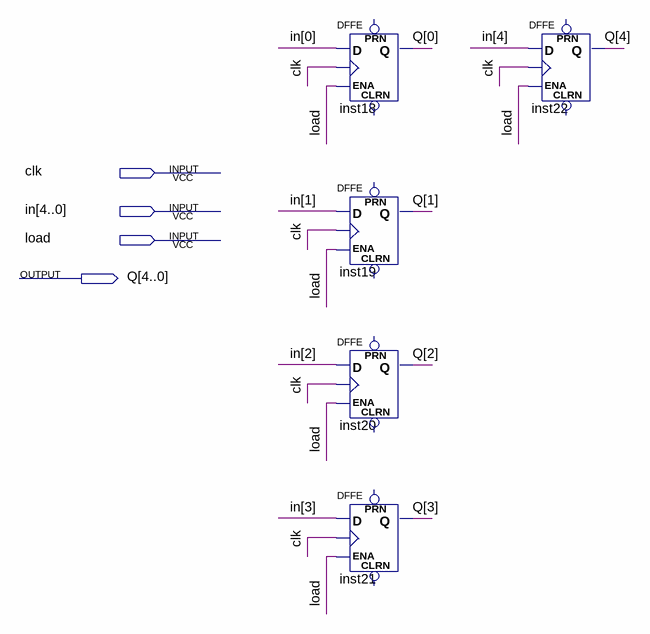
[diagram p0: schematic sheet]
// Quartus schematic Register5.bdf as structural Verilog: 5 symbols, 4 pins
module Register5 (
  input  clk,
  input  [4:0] in,
  input  load,
  output [4:0] Q
);

  DFFE inst18 (.D(in[0]), .CLK(clk), .ENA(load), .Q(Q[0]));  // open: PRN, CLRN
  DFFE inst19 (.D(in[1]), .CLK(clk), .ENA(load), .Q(Q[1]));  // open: PRN, CLRN
  DFFE inst20 (.D(in[2]), .CLK(clk), .ENA(load), .Q(Q[2]));  // open: PRN, CLRN
  DFFE inst21 (.D(in[3]), .CLK(clk), .ENA(load), .Q(Q[3]));  // open: PRN, CLRN
  DFFE inst22 (.D(in[4]), .CLK(clk), .ENA(load), .Q(Q[4]));  // open: PRN, CLRN
endmodule
